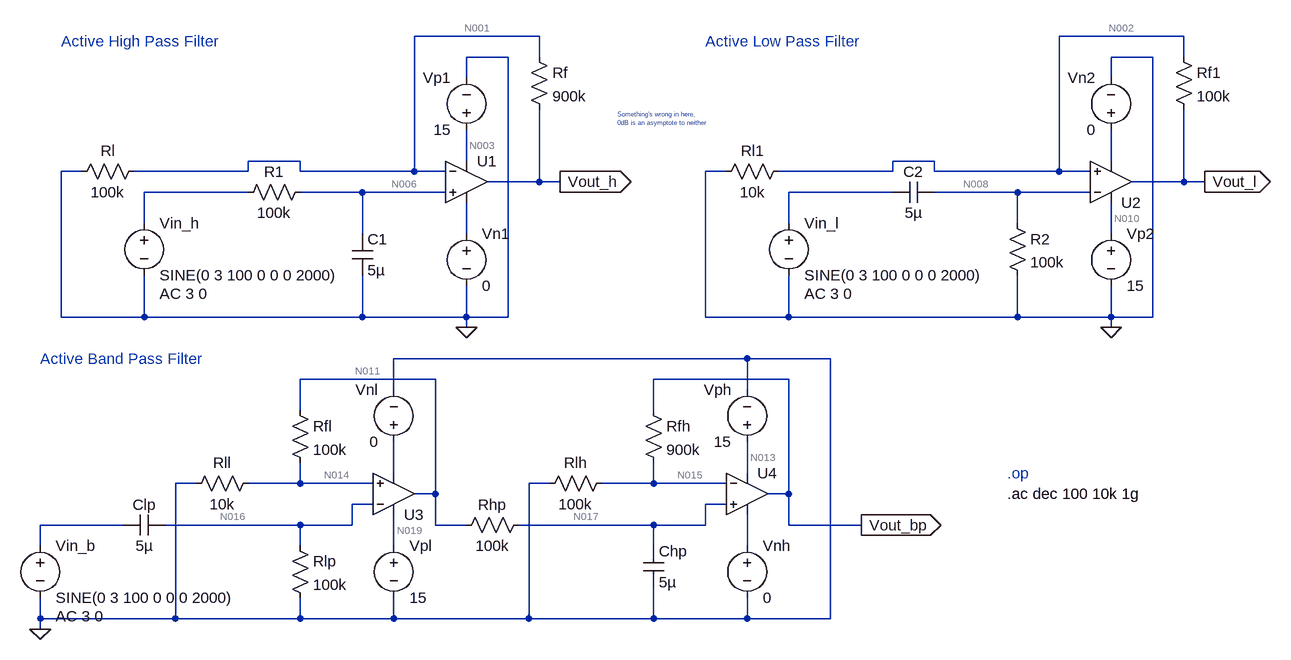
[diagram p0: schematic Active Filter - 1.asc]
Active Filter - 1.asc, the LTspice schematic file:
Version 4.1
SHEET 1 1496 1024
WIRE 336 -64 144 -64
WIRE 1328 -64 1136 -64
WIRE 288 -32 224 -32
WIRE 336 -32 336 -64
WIRE 1280 -32 1216 -32
WIRE 1328 -32 1328 -64
WIRE 224 0 224 -32
WIRE 1216 0 1216 -32
WIRE -32 128 -112 128
WIRE 224 128 224 80
WIRE 944 128 880 128
WIRE 1216 128 1216 80
WIRE -368 144 -400 144
WIRE -112 144 -112 128
WIRE -112 144 -288 144
WIRE -32 144 -32 128
WIRE 144 144 144 -64
WIRE 144 144 -32 144
WIRE 192 144 144 144
WIRE 624 144 592 144
WIRE 880 144 880 128
WIRE 880 144 704 144
WIRE 944 144 944 128
WIRE 1136 144 1136 -64
WIRE 1136 144 944 144
WIRE 1184 144 1136 144
WIRE 336 160 336 48
WIRE 336 160 256 160
WIRE 368 160 336 160
WIRE 1328 160 1328 48
WIRE 1328 160 1248 160
WIRE 1360 160 1328 160
WIRE -112 176 -272 176
WIRE 64 176 -32 176
WIRE 192 176 64 176
WIRE 880 176 720 176
WIRE 1072 176 944 176
WIRE 1184 176 1072 176
WIRE -272 224 -272 176
WIRE 720 224 720 176
WIRE 1072 224 1072 176
WIRE 64 240 64 176
WIRE 224 240 224 192
WIRE 1216 240 1216 192
WIRE -400 368 -400 144
WIRE -272 368 -272 304
WIRE -272 368 -400 368
WIRE 64 368 64 304
WIRE 64 368 -272 368
WIRE 224 368 224 320
WIRE 224 368 64 368
WIRE 288 368 288 -32
WIRE 288 368 224 368
WIRE 592 368 592 144
WIRE 720 368 720 304
WIRE 720 368 592 368
WIRE 1072 368 1072 304
WIRE 1072 368 720 368
WIRE 1216 368 1216 320
WIRE 1216 368 1072 368
WIRE 1280 368 1280 -32
WIRE 1280 368 1216 368
WIRE 224 384 224 368
WIRE 1216 384 1216 368
WIRE 656 432 112 432
WIRE 784 432 656 432
WIRE 176 464 -32 464
WIRE 720 464 512 464
WIRE 112 480 112 432
WIRE 656 480 656 432
WIRE -32 512 -32 464
WIRE 512 512 512 464
WIRE 112 608 112 560
WIRE 656 608 656 560
WIRE -192 624 -224 624
WIRE -32 624 -32 592
WIRE -32 624 -112 624
WIRE 80 624 -32 624
WIRE 352 624 320 624
WIRE 512 624 512 592
WIRE 512 624 432 624
WIRE 624 624 512 624
WIRE 176 640 176 464
WIRE 176 640 144 640
WIRE 720 640 720 464
WIRE 720 640 688 640
WIRE 80 656 48 656
WIRE 624 656 592 656
WIRE -304 688 -432 688
WIRE -32 688 -240 688
WIRE 48 688 48 656
WIRE 48 688 -32 688
WIRE 176 688 176 640
WIRE 224 688 176 688
WIRE 512 688 304 688
WIRE 592 688 592 656
WIRE 592 688 512 688
WIRE 720 688 720 640
WIRE 832 688 720 688
WIRE -432 720 -432 688
WIRE -32 720 -32 688
WIRE 112 720 112 672
WIRE 512 720 512 688
WIRE 656 720 656 672
WIRE -432 832 -432 800
WIRE -224 832 -224 624
WIRE -224 832 -432 832
WIRE -32 832 -32 800
WIRE -32 832 -224 832
WIRE 112 832 112 800
WIRE 112 832 -32 832
WIRE 320 832 320 624
WIRE 320 832 112 832
WIRE 512 832 512 784
WIRE 512 832 320 832
WIRE 656 832 656 800
WIRE 656 832 512 832
WIRE 784 832 784 432
WIRE 784 832 656 832
WIRE -432 848 -432 832
FLAG 224 384 0
FLAG 368 160 Vout_h
IOPIN 368 160 Out
FLAG 1216 384 0
FLAG 1360 160 Vout_l
IOPIN 1360 160 Out
FLAG -432 848 0
FLAG 832 688 Vout_bp
IOPIN 832 688 Out
SYMBOL OpAmps\\UniversalOpAmp 224 160 R0
SYMATTR InstName U1
SYMBOL voltage 224 96 R180
WINDOW 0 24 96 Left 2
WINDOW 3 24 16 Left 2
WINDOW 123 0 0 Left 0
WINDOW 39 0 0 Left 0
SYMATTR InstName Vp1
SYMATTR Value 15
SYMBOL voltage 224 224 R0
WINDOW 123 0 0 Left 0
WINDOW 39 0 0 Left 0
SYMATTR InstName Vn1
SYMATTR Value 0
SYMBOL voltage -272 208 R0
WINDOW 123 24 124 Left 2
WINDOW 39 0 0 Left 0
SYMATTR Value2 AC 3 0
SYMATTR InstName Vin_h
SYMATTR Value SINE(0 3 100 0 0 0 2000)
SYMBOL res -16 160 R90
WINDOW 0 0 56 VBottom 2
WINDOW 3 32 56 VTop 2
SYMATTR InstName R1
SYMATTR Value 100k
SYMBOL cap 48 240 R0
SYMATTR InstName C1
SYMATTR Value 5µ
SYMBOL res 320 -48 R0
SYMATTR InstName Rf
SYMATTR Value 900k
SYMBOL res -272 128 R90
WINDOW 0 0 56 VBottom 2
WINDOW 3 32 56 VTop 2
SYMATTR InstName Rl
SYMATTR Value 100k
SYMBOL OpAmps\\UniversalOpAmp 1216 160 M180
SYMATTR InstName U2
SYMBOL voltage 1216 96 R180
WINDOW 0 24 96 Left 2
WINDOW 3 24 16 Left 2
WINDOW 123 0 0 Left 0
WINDOW 39 0 0 Left 0
SYMATTR InstName Vn2
SYMATTR Value 0
SYMBOL voltage 1216 224 R0
WINDOW 123 0 0 Left 0
WINDOW 39 0 0 Left 0
SYMATTR InstName Vp2
SYMATTR Value 15
SYMBOL voltage 720 208 R0
WINDOW 123 24 124 Left 2
WINDOW 39 0 0 Left 0
SYMATTR Value2 AC 3 0
SYMATTR InstName Vin_l
SYMATTR Value SINE(0 3 100 0 0 0 2000)
SYMBOL res 1312 -48 R0
SYMATTR InstName Rf1
SYMATTR Value 100k
SYMBOL res 720 128 R90
WINDOW 0 0 56 VBottom 2
WINDOW 3 32 56 VTop 2
SYMATTR InstName Rl1
SYMATTR Value 10k
SYMBOL res 1056 208 R0
SYMATTR InstName R2
SYMATTR Value 100k
SYMBOL cap 944 160 R90
WINDOW 0 0 32 VBottom 2
WINDOW 3 32 32 VTop 2
SYMATTR InstName C2
SYMATTR Value 5µ
SYMBOL OpAmps\\UniversalOpAmp 112 640 M180
SYMATTR InstName U3
SYMBOL OpAmps\\UniversalOpAmp 656 640 R0
SYMATTR InstName U4
SYMBOL res -48 704 R0
SYMATTR InstName Rlp
SYMATTR Value 100k
SYMBOL res -96 608 R90
WINDOW 0 0 56 VBottom 2
WINDOW 3 32 56 VTop 2
SYMATTR InstName Rll
SYMATTR Value 10k
SYMBOL res 448 608 R90
WINDOW 0 0 56 VBottom 2
WINDOW 3 32 56 VTop 2
SYMATTR InstName Rlh
SYMATTR Value 100k
SYMBOL res -48 496 R0
SYMATTR InstName Rfl
SYMATTR Value 100k
SYMBOL res 496 496 R0
SYMATTR InstName Rfh
SYMATTR Value 900k
SYMBOL cap 496 720 R0
SYMATTR InstName Chp
SYMATTR Value 5µ
SYMBOL cap -240 672 R90
WINDOW 0 0 32 VBottom 2
WINDOW 3 32 32 VTop 2
SYMATTR InstName Clp
SYMATTR Value 5µ
SYMBOL res 320 672 R90
WINDOW 0 0 56 VBottom 2
WINDOW 3 32 56 VTop 2
SYMATTR InstName Rhp
SYMATTR Value 100k
SYMBOL voltage -432 704 R0
WINDOW 123 24 124 Left 2
WINDOW 39 0 0 Left 0
SYMATTR InstName Vin_b
SYMATTR Value SINE(0 3 100 0 0 0 2000)
SYMATTR Value2 AC 3 0
SYMBOL voltage 112 704 R0
WINDOW 123 0 0 Left 0
WINDOW 39 0 0 Left 0
SYMATTR InstName Vpl
SYMATTR Value 15
SYMBOL voltage 112 576 R180
WINDOW 0 24 96 Left 2
WINDOW 3 24 16 Left 2
WINDOW 123 0 0 Left 0
WINDOW 39 0 0 Left 0
SYMATTR InstName Vnl
SYMATTR Value 0
SYMBOL voltage 656 576 R180
WINDOW 0 24 96 Left 2
WINDOW 3 24 16 Left 2
WINDOW 123 0 0 Left 0
WINDOW 39 0 0 Left 0
SYMATTR InstName Vph
SYMATTR Value 15
SYMBOL voltage 656 704 R0
WINDOW 123 0 0 Left 0
WINDOW 39 0 0 Left 0
SYMATTR InstName Vnh
SYMATTR Value 0
TEXT 1056 608 Left 2 ;.op
TEXT 1056 640 Left 2 !.ac dec 100 10k 1g
TEXT -400 -56 Left 2 ;Active High Pass Filter
TEXT 592 -56 Left 2 ;Active Low Pass Filter
TEXT 456 56 Left 0 ;Something's wrong in here,\n0dB is an asymptote to neither
TEXT -432 432 Left 2 ;Active Band Pass Filter

The netlist it stands for:
* Active Filter - 1.asc
X§U1 N006 N001 N003 N009 Vout_h level1 Avol=1Meg GBW=10Meg Vos=0 En=0 Enk=0 In=0 Ink=0 Rin=500Meg  ; pins In+ In- V+ V- OUT
Vp1 N003 0 15
Vn1 N009 0 0
Vin_h N005 0 SINE(0 3 100 0 0 0 2000) AC 3 0
R1 N006 N005 100k
C1 N006 0 5µ
Rf N001 Vout_h 900k
Rl N001 0 100k
X§U2 N002 N008 N010 N004 Vout_l level1 Avol=1Meg GBW=10Meg Vos=0 En=0 Enk=0 In=0 Ink=0 Rin=500Meg  ; pins In+ In- V+ V- OUT
Vn2 N004 0 0
Vp2 N010 0 15
Vin_l N007 0 SINE(0 3 100 0 0 0 2000) AC 3 0
Rf1 N002 Vout_l 100k
Rl1 N002 0 10k
R2 N008 0 100k
C2 N008 N007 5µ
X§U3 N014 N016 N019 N012 N011 level1 Avol=1Meg GBW=10Meg Vos=0 En=0 Enk=0 In=0 Ink=0 Rin=500Meg  ; pins In+ In- V+ V- OUT
X§U4 N017 N015 N013 N020 Vout_bp level1 Avol=1Meg GBW=10Meg Vos=0 En=0 Enk=0 In=0 Ink=0 Rin=500Meg  ; pins In+ In- V+ V- OUT
Rlp N016 0 100k
Rll N014 0 10k
Rlh N015 0 100k
Rfl N011 N014 100k
Rfh Vout_bp N015 900k
Chp N017 0 5µ
Clp N016 N018 5µ
Rhp N017 N011 100k
Vin_b N018 0 SINE(0 3 100 0 0 0 2000) AC 3 0
Vpl N019 0 15
Vnl N012 0 0
Vph N013 0 15
Vnh N020 0 0
* .op
.ac dec 100 10k 1g
* Active High Pass Filter
* Active Low Pass Filter
* Something's wrong in here,
* 0dB is an asymptote to neither
* Active Band Pass Filter
.lib UniversalOpAmp1.lib
.backanno
.end

* Results of the author's LTspice run, read from the files saved beside the schematic
* Operating Point, zero values left out:
*   V(n001) = 1.5 mV
*   V(vout_h) = 1.5 mV
*   V(n002) = 1.5 mV
*   V(n014) = 1.5 mV
*   V(n019) = 15 V
*   V(n017) = 16.49 mV
*   V(n013) = 15 V
*   V(n006) = 1.5 mV
*   V(n003) = 15 V
*   V(n008) = 1.5 mV
*   V(n010) = 15 V
*   V(vout_l) = 15 mV
*   V(n016) = 1.5 mV
*   V(n011) = 15 mV
*   V(n015) = 16.49 mV
*   V(vout_bp) = 151.5 mV
*   I(Vp1) = -30 nA
*   I(Rf1) = -135 nA
*   I(Rlp) = 15 nA
*   I(Rlh) = 164.9 nA
*   I(Vnh) = 32.99 pA
*   I(Vin_h) = 15 nA
*   I(Vp2) = -30 nA
*   I(Rfh) = 150 nA
*   I(Rhp) = 14.97 nA
*   I(Vnl) = 2.999 pA
*   I(Vn1) = 2.999 pA
*   I(Rl) = 15 nA
*   I(R2) = 15 nA
*   I(Rll) = 150 nA
*   I(R1) = 15 nA
*   I(Vn2) = 2.999 pA
*   I(Rl1) = 150 nA
*   I(Rfl) = 135 nA
*   I(Vpl) = -30 nA
*   I(Vph) = -29.97 nA
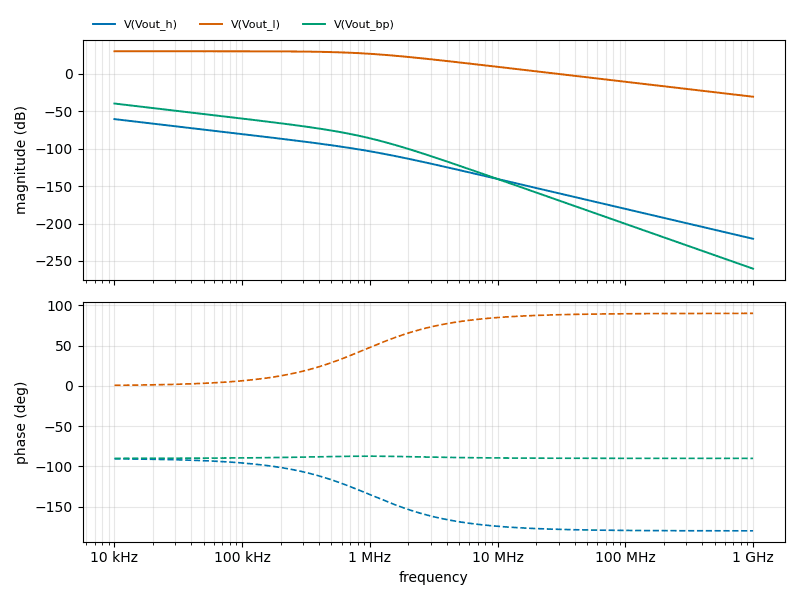
[diagram p1: AC Analysis of Active Filter - 1.asc, plotted from the saved traces]
* AC Analysis, 1 run:
*   V(Vout_h): -60.40 dB at 10 kHz, -220.40 dB at 1 GHz, peak -60.40 dB at 10 kHz, 3 dB below the peak at 14.14 kHz
*   V(Vout_l): 30.37 dB at 10 kHz, -30.46 dB at 1 GHz, peak 30.37 dB at 10 kHz, 3 dB below the peak at 909.1 kHz
*   V(Vout_bp): -39.57 dB at 10 kHz, -260.40 dB at 1 GHz, peak -39.57 dB at 10 kHz, 3 dB below the peak at 14.14 kHz